# EAGLE design Costume Controller Base Board (EAGLE 6.5.0)
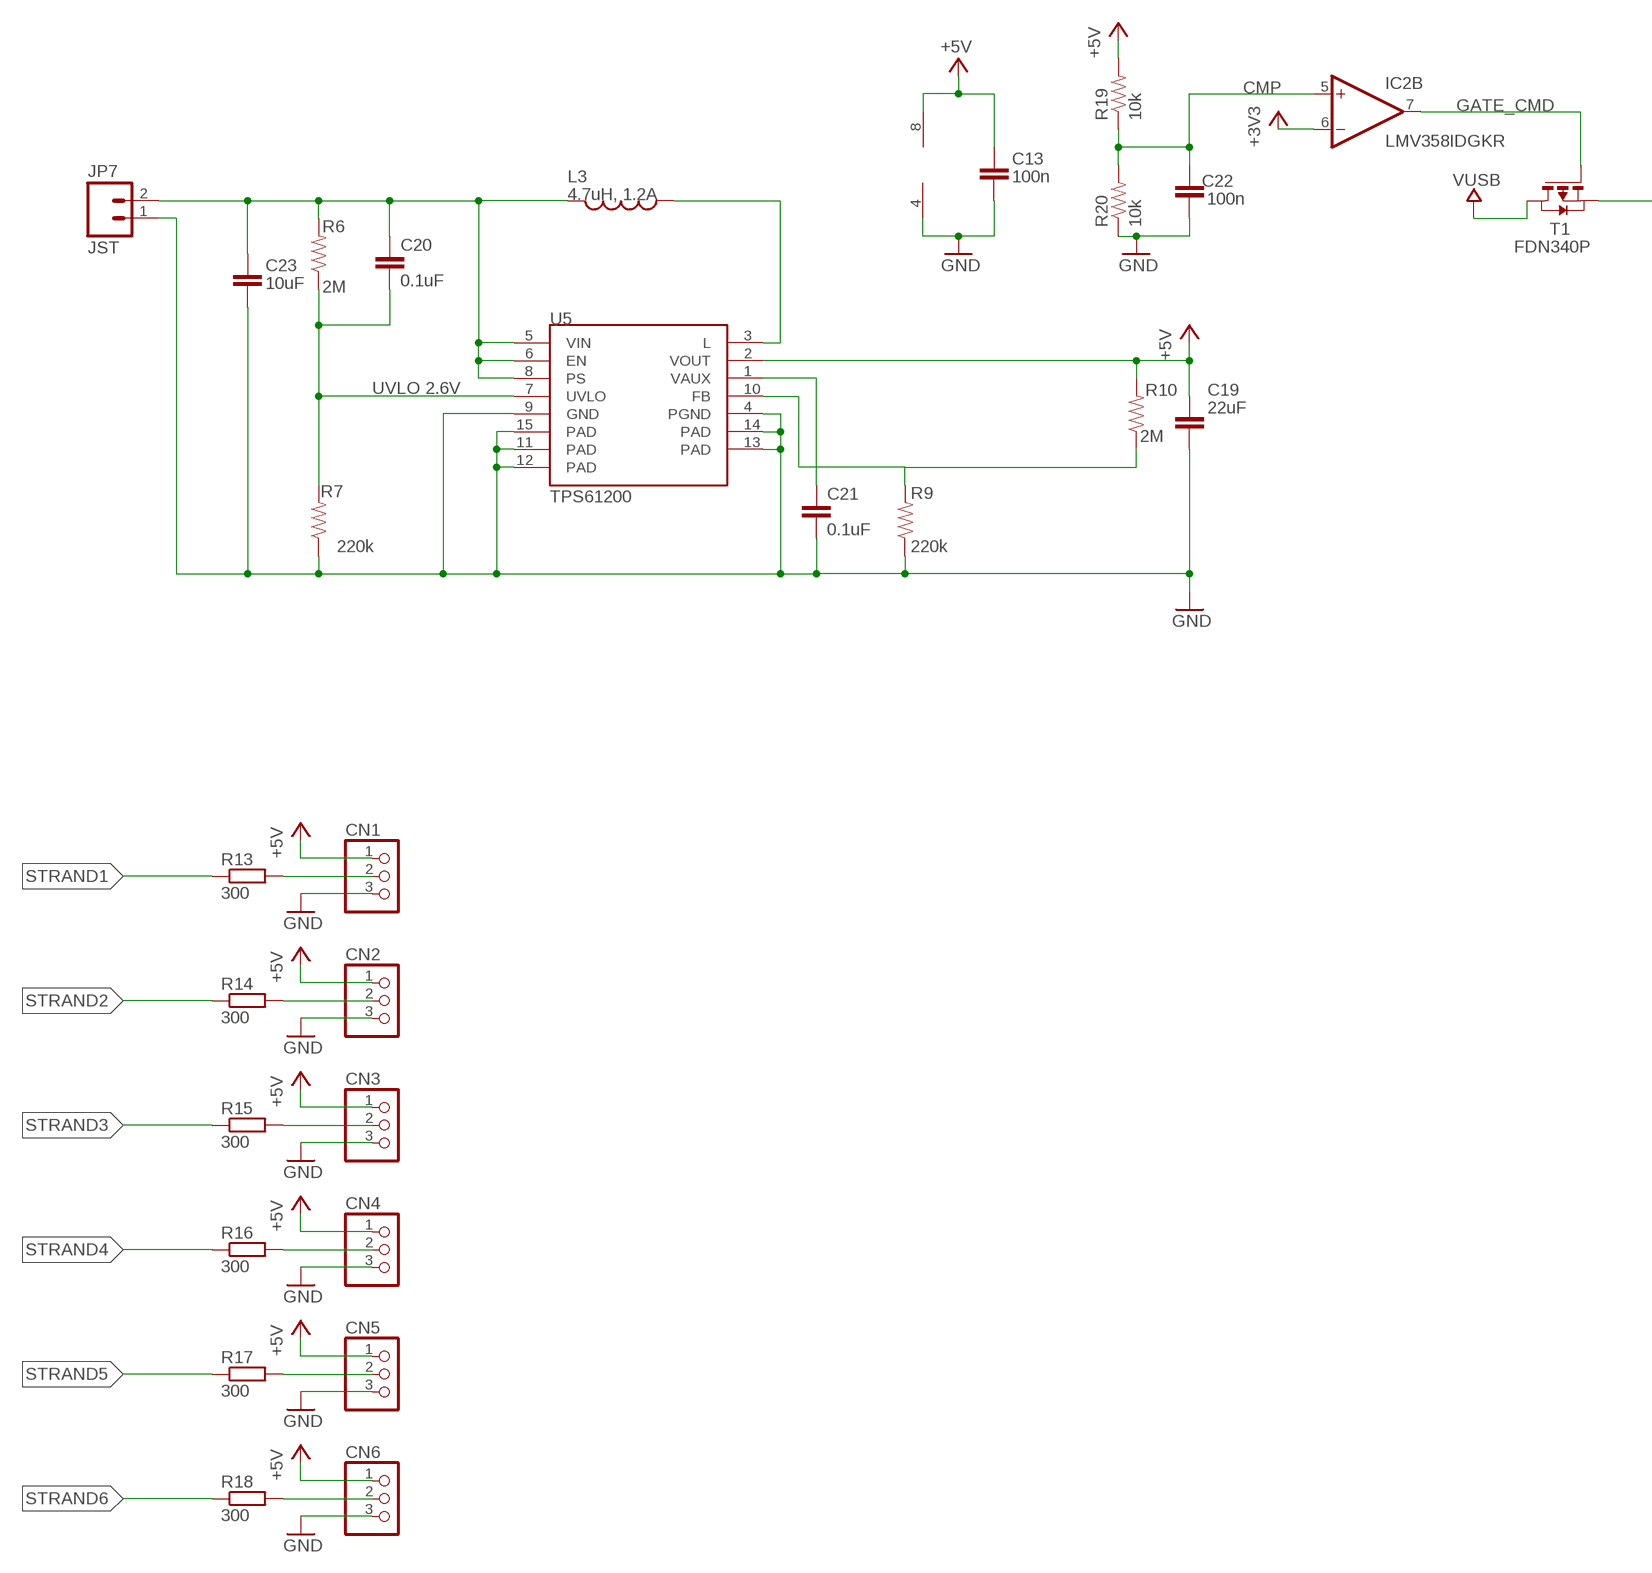
[diagram p0: schematic, sheet 1, part 1 of 2]
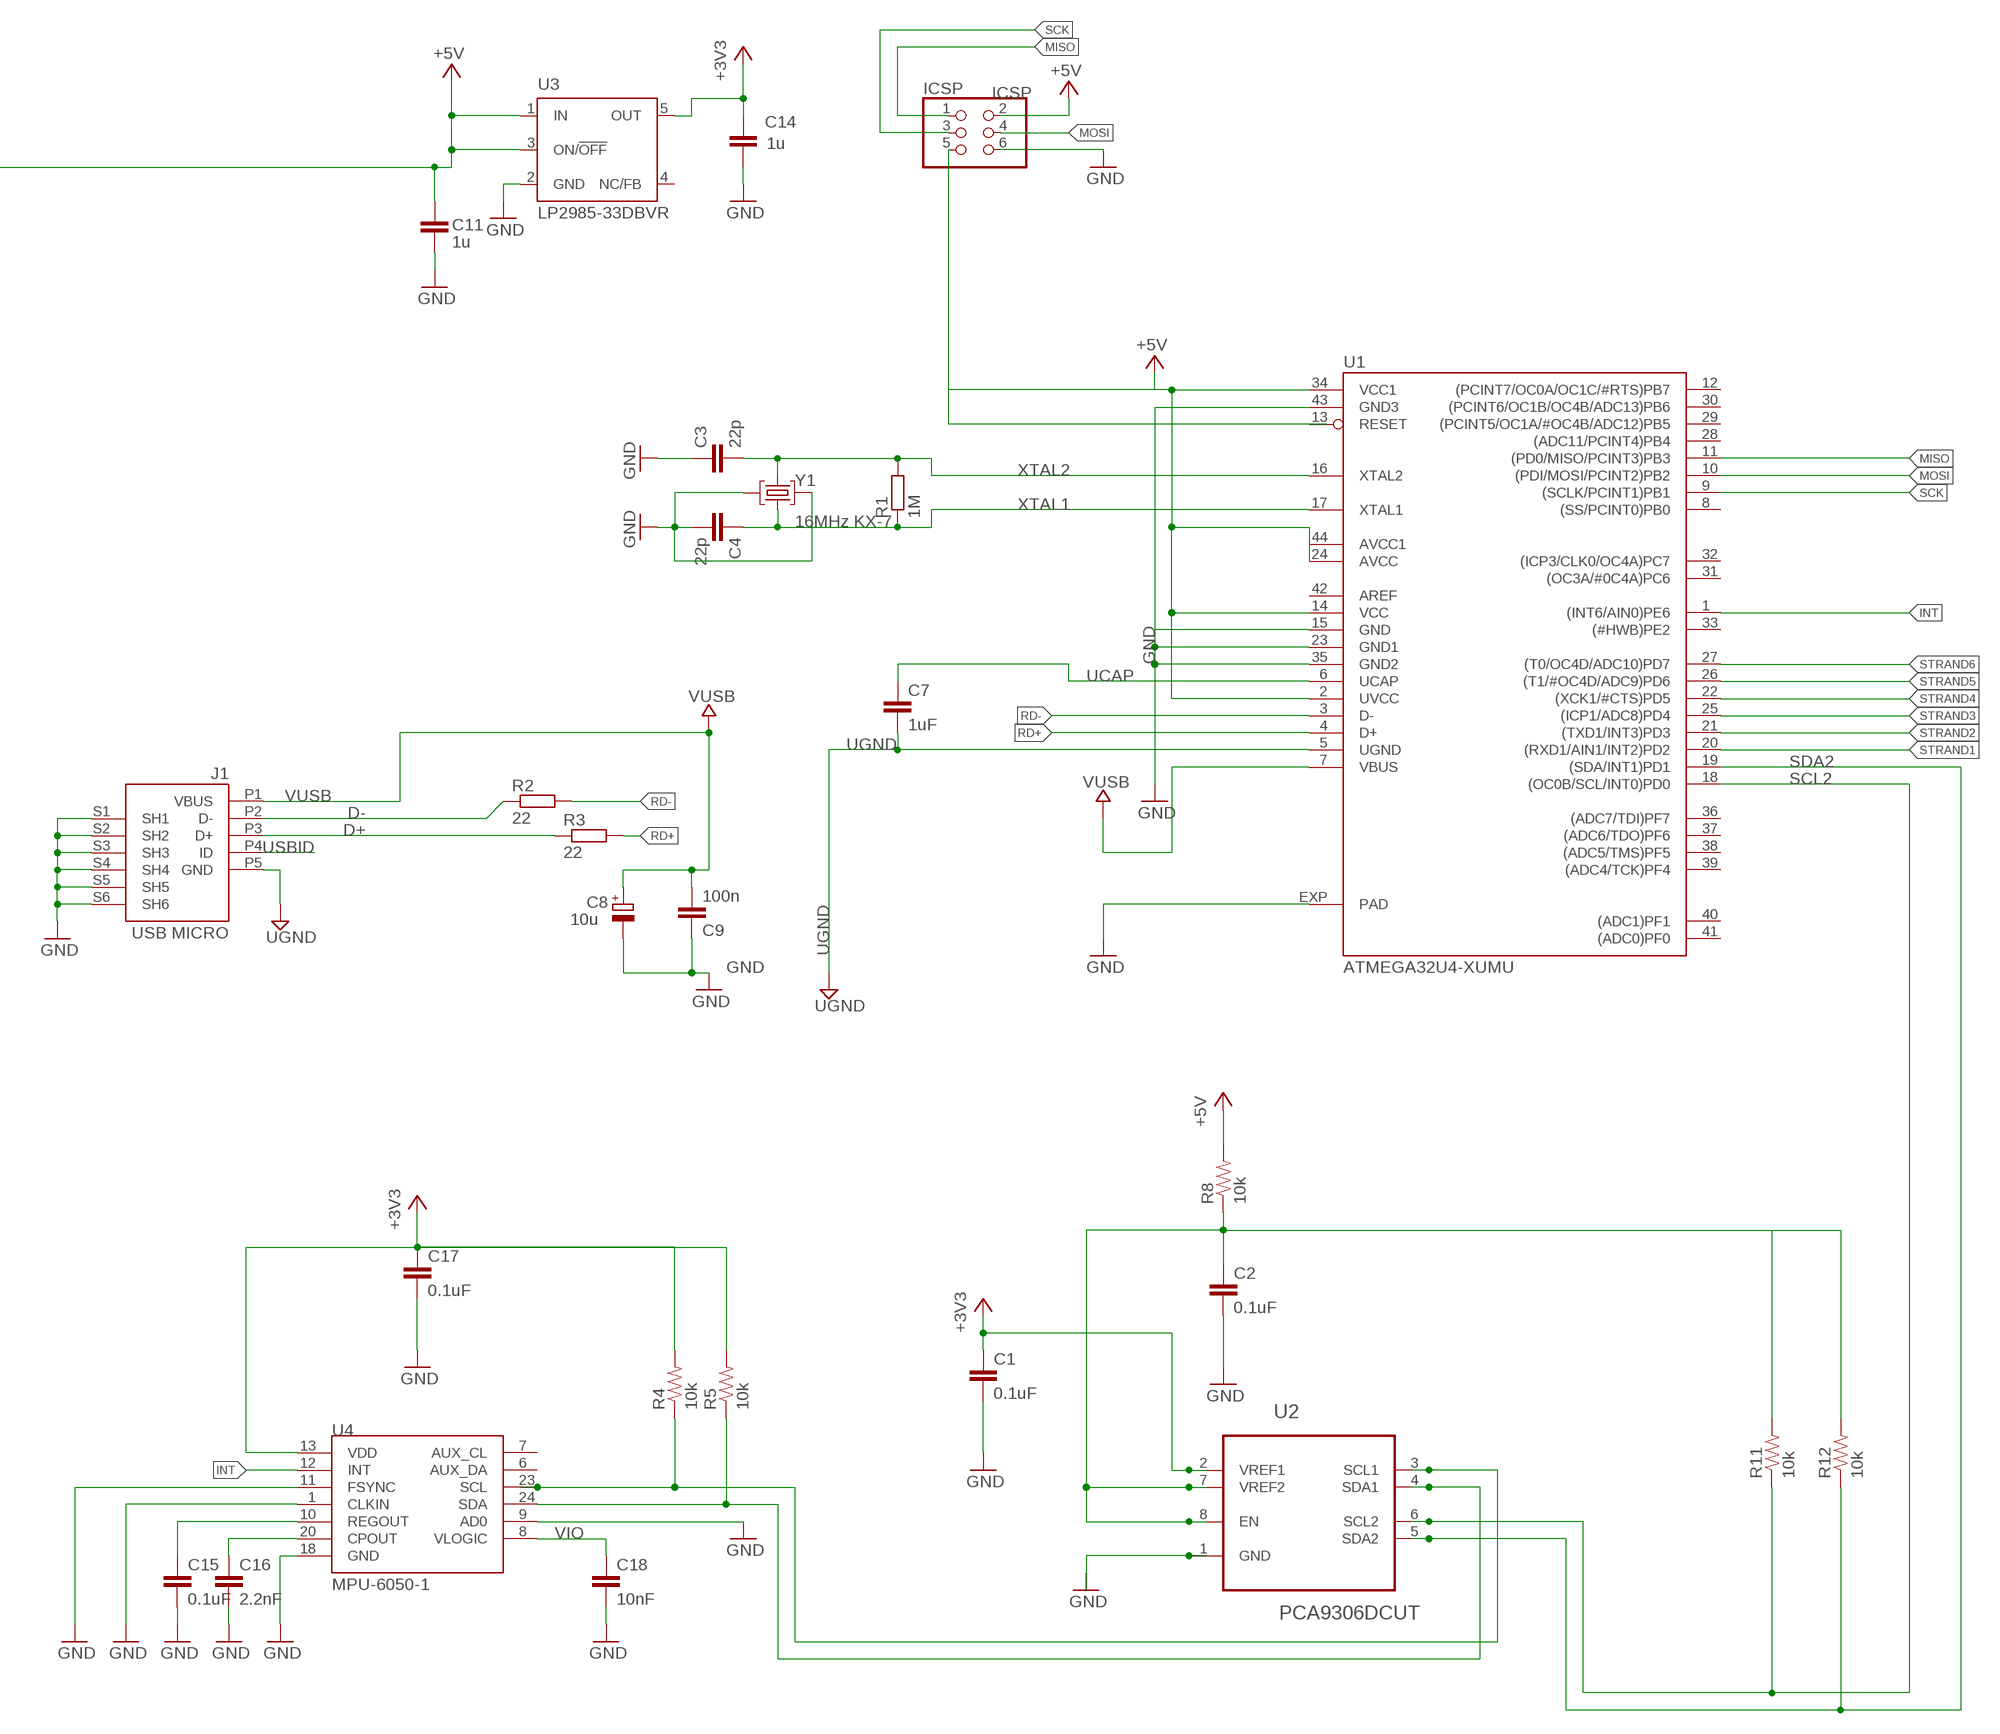
[diagram p1: schematic, sheet 1, part 2 of 2]

## Parts
C1  0.1uF  CAP0603-CAP  [0603-CAP]
C2  0.1uF  CAP0603-CAP  [0603-CAP]
C3  22p  C-EUC0603  [C0603-ROUND]
C4  22p  C-EUC0603  [C0603-ROUND]
C7  1uF  C-EUC0603  [C0603-ROUND]
C8  10u  CPOL-EUSMCB  [SMC_B]
C9  100n  C-EUC0603  [C0603-ROUND]
C11  1u  C-EUC0603  [C0603-ROUND]
C13  100n  C-EUC0603  [C0603-ROUND]
C14  1u  C-EUC0603  [C0603-ROUND]
C15  0.1uF  CAP0603-CAP  [0603-CAP]
C16  2.2nF  CAP0603-CAP  [0603-CAP]
C17  0.1uF  CAP0603-CAP  [0603-CAP]
C18  10nF  CAP0603-CAP  [0603-CAP]
C19  22uF  C-EUC0603  [C0603]
C20  0.1uF  CAP0603-CAP  [0603-CAP]
C21  0.1uF  CAP0603-CAP  [0603-CAP]
C22  100n  C-EUC0603  [C0603-ROUND]
C23  10uF  CAP1206  [1206]
CN1  JST_3PIN  [JSTPH3]
CN2  JST_3PIN  [JSTPH3]
CN3  JST_3PIN  [JSTPH3]
CN4  JST_3PIN  [JSTPH3]
CN5  JST_3PIN  [JSTPH3]
CN6  JST_3PIN  [JSTPH3]
IC2  LMV358IDGKR  LMV358MMX  [MSOP08]
ICSP  ICSP  PINHD-2X3  [2X03]
J1  USB MICRO  MYCON2_USB-MINI-B  [CON2_USB_MICRO_B_AT]
JP7  JST  M02-JST-2MM-SMT  [JST-2-SMD]
L3  4.7uH, 1.2A  INDUCTOR.  [CDRH2D09]
R1  1M  R-EU_R0603  [R0603]
R2  22  R-EU_R0603  [R0603]
R3  22  R-EU_R0603  [R0603]
R4  10k  RESISTOR0603-RES  [0603-RES]
R5  10k  RESISTOR0603-RES  [0603-RES]
R6  2M  RESISTOR0603-RES  [0603-RES]
R7  220k  RESISTOR0603-RES  [0603-RES]
R8  10k  RESISTOR0603-RES  [0603-RES]
R9  220k  RESISTOR0603-RES  [0603-RES]
R10  2M  RESISTOR0603-RES  [0603-RES]
R11  10k  RESISTOR0603-RES  [0603-RES]
R12  10k  RESISTOR0603-RES  [0603-RES]
R13  300  R-EU_R0603  [R0603]
R14  300  R-EU_R0603  [R0603]
R15  300  R-EU_R0603  [R0603]
R16  300  R-EU_R0603  [R0603]
R17  300  R-EU_R0603  [R0603]
R18  300  R-EU_R0603  [R0603]
R19  10k  RESISTOR0603-RES  [0603-RES]
R20  10k  RESISTOR0603-RES  [0603-RES]
T1  FDN340P  PMOSSOT23  [SOT-23]
U1  ATMEGA32U4-XUMU  [QFN44ML7X7]
U2  PCA9306DCUT  [SOP50P310X90-8N]
U3  LP2985-33DBVR  LP2985-XXDBVR33  [SOT23-DBV]
U4  MPU-6050-1  [QFN-24-4MM2]
U5  TPS61200  [QFN-10_PAD]
Y1  16MHz KX-7  CRYSTAL-3.2-2.5  [CRYSTAL-3.2-2.5]

## Nets
+3V3: C1.1 C14.2 C17.1 IC2.6(B:-IN) R4.2 R5.2 U2.2(VREF1) U3.5(OUT) U4.13(VDD)
+5V [usbvcc]: C11.2 C13.1 C19.1 CN1.1 CN2.1 CN3.1 CN4.1 CN5.1 CN6.1 IC2.8(P:V+) ICSP.2 ICSP.5 R8.2 R10.2 R19.2 T1.2(S) U1.2(UVCC) U1.14(VCC) U1.24(AVCC) U1.34(VCC1) U1.44(AVCC1) U3.1(IN) U3.3(ON/!OFF) U5.2(VOUT)
CMP: C22.2 IC2.5(B:+IN) R19.1 R20.2
D+: J1.P3(D+) R3.1
D-: J1.P2(D-) R2.1
FB: R9.2 R10.1 U5.10(FB)
GATE_CMD: IC2.7(B:OUT) T1.3(G)
GND [gnd]: C1.2 C2.2 C3.1 C4.2 C8.- C9.1 C11.1 C13.2 C14.1 C15.2 C16.2 C17.2 C18.2 C19.2 C21.2 C22.1 C23.2 CN1.3 CN2.3 CN3.3 CN4.3 CN5.3 CN6.3 IC2.4(P:V-) ICSP.6 J1.S1(SH1) J1.S2(SH2) J1.S3(SH3) J1.S4(SH4) J1.S5(SH5) J1.S6(SH6) JP7.1 R7.1 R9.1 R20.1 U1.15(GND) U1.23(GND1) U1.35(GND2) U1.43(GND3) U1.EXP(PAD) U2.1(GND) U3.2(GND) U4.1(CLKIN) U4.9(AD0) U4.11(FSYNC) U4.18(GND) U5.4(PGND) U5.9(GND) U5.11(PAD) U5.12(PAD) U5.13(PAD) U5.14(PAD) U5.15(PAD) Y1.2(GND) Y1.4(GND)
INT: U1.1((INT6/AIN0)PE6) U4.12(INT)
MISO: ICSP.1 U1.11((PD0/MISO/PCINT3)PB3)
MOSI: ICSP.4 U1.10((PDI/MOSI/PCINT2)PB2)
N$1: C16.1 U4.20(CPOUT)
N$2: C2.1 R8.1 R11.2 R12.2 U2.7(VREF2) U2.8(EN)
N$3: CN6.2 R18.2
N$4: L3.P$1 U5.3(L)
N$5: C15.1 U4.10(REGOUT)
N$6: CN5.2 R17.2
N$7: CN4.2 R16.2
N$8: CN3.2 R15.2
N$9: C21.1 U5.1(VAUX)
N$10: CN2.2 R14.2
N$11: CN1.2 R13.2
RD+: R3.2 U1.4(D+)
RD-: R2.2 U1.3(D-)
SCK: ICSP.3 U1.9((SCLK/PCINT1)PB1)
SCL1: R4.1 U2.3(SCL1) U4.23(SCL)
SCL2: R11.1 U1.18((OC0B/SCL/INT0)PD0) U2.6(SCL2)
SDA1: R5.1 U2.4(SDA1) U4.24(SDA)
SDA2: R12.1 U1.19((SDA/INT1)PD1) U2.5(SDA2)
STRAND1: R13.1 U1.20((RXD1/AIN1/INT2)PD2)
STRAND2: R14.1 U1.21((TXD1/INT3)PD3)
STRAND3: R15.1 U1.25((ICP1/ADC8)PD4)
STRAND4: R16.1 U1.22((XCK1/#CTS)PD5)
STRAND5: R17.1 U1.26((T1/#OC4D/ADC9)PD6)
STRAND6: R18.1 U1.27((T0/OC4D/ADC10)PD7)
UCAP: C7.1 U1.6(UCAP)
UGND [gnd]: C7.2 J1.P5(GND) U1.5(UGND)
USBID: J1.P4(ID)
UVLO: C20.2 R6.1 R7.2 U5.7(UVLO)
VIN [power]: C20.1 C23.1 JP7.2 L3.P$2 R6.2 U5.5(VIN) U5.6(EN) U5.8(PS)
VIO: C18.1 U4.8(VLOGIC)
VUSB: C8.+ C9.2 J1.P1(VBUS) T1.1(D) U1.7(VBUS)
XTAL1: C4.1 R1.1 U1.17(XTAL1) Y1.1(C1)
XTAL2: C3.2 R1.2 U1.16(XTAL2) Y1.3(C2)
Unconnected: IC2.1(A:OUT) IC2.2(A:-IN) IC2.3(A:+IN) U1.8((SS/PCINT0)PB0) U1.12((PCINT7/OC0A/OC1C/#RTS)PB7) U1.13(RESET) U1.28((ADC11/PCINT4)PB4) U1.29((PCINT5/OC1A/#OC4B/ADC12)PB5) U1.30((PCINT6/OC1B/OC4B/ADC13)PB6) U1.31((OC3A/#0C4A)PC6) U1.32((ICP3/CLK0/OC4A)PC7) U1.33((#HWB)PE2) U1.36((ADC7/TDI)PF7) U1.37((ADC6/TDO)PF6) U1.38((ADC5/TMS)PF5) U1.39((ADC4/TCK)PF4) U1.40((ADC1)PF1) U1.41((ADC0)PF0) U3.4(NC/FB) U4.6(AUX_DA) U4.7(AUX_CL)

## Notes on the sheet
- UVLO 2.6V

## Power pins joined to a net without a drawn wire
AREF: U1.42(AREF)

## Library data of the parts
C1 C2 C15-C18 C20 C21 = SparkFun:CAP: Capacitor Standard 0603 ceramic capacitor, and 0.1" leaded capacitor.
C3 C4 C7 C9 C11 C13 C14 C22 = SmartPrj:C-EU: CAPACITOR, European symbol
C8 = rcl:CPOL-EU: POLARIZED CAPACITOR, European symbol
C19 = resistor:C-EU: CAPACITOR, European symbol
C23 = CH_passive:CAP: Capacitor Standard 0603 ceramic capacitor, and 0.1" leaded capacitor.
CN1-CN6 = adafruit:JST_3PIN
IC2 = linear:LMV358?*: Dual General Purpose, Low Voltage, Rail-to-Rail Output Operational Amplifiers Source: http://www.national.com/mpf/LM/LMV321.html http://www.national.com/dt/lmv_qual.pdf
ICSP = SmartPrj:PINHD-2X3: PIN HEADER
J1 = SmartPrj:MYCON2_USB-MINI-B
JP7 = SparkFun:M02: Header 2 Standard 2-pin 0.1" header. Use with straight break away headers (SKU : PRT-00116), right angle break away headers (PRT-00553), swiss pins (PRT-00743), machine pins (PRT-00117), and female headers (PRT-00115). Molex polarized connector foot print use with SKU : PRT-08233 with associated crimp pins and housings.
L3 = SparkFun:INDUCTOR: Inductors Basic Inductor/Choke - 0603 and 1206. Footprints are not proven and vary greatly between part numbers.
R1-R3 R13-R18 = resistor:R-EU_: RESISTOR, European symbol
R4-R12 R19 R20 = SparkFun:RESISTOR: Resistor Basic schematic elements and footprints for 0603, 1206, and PTH resistors.
T1 = zetex:PMOSSOT23: MOS FET
U1 = SmartPrj:ATMEGA32U4-XU
U2 = Texas Instruments_By_element14_Batch_1:PCA9306DCUT: VOLTAGE-LEVEL TRANSLATOR; MPN: PCA9306DCUT; OC_FARNELL: -; OC_NEWARK: 24K4705; PACKAGE: VSSOP-8; SUPPLIER: Texas Instruments
U3 = SmartPrj:LP2985-XXDBVR: ULTRALOW-POWER 50-mA LOW-DROPOUT LINEAR REGULATORS 50-mA Low-Dropout Regulator Source: http://focus.ti.com/lit/ds/symlink/tps77001.pdf
U4 = Testing:MPU-6050
U5 = SparkFun:TPS61200: DC to DC Booster
Y1 = SmartPrj:CRYSTAL-3.2-2.5

## Net classes
1 power: width 0.254 mm, drill 0.61 mm, clearance 0.254 mm
2 gnd: width 0.254 mm, drill 0.61 mm, clearance 0.254 mm
3 usbvcc: width 0.254 mm, drill 0.61 mm, clearance 0.254 mm
4 aref: width 0.254 mm, drill 0.61 mm, clearance 0.254 mm

## Board
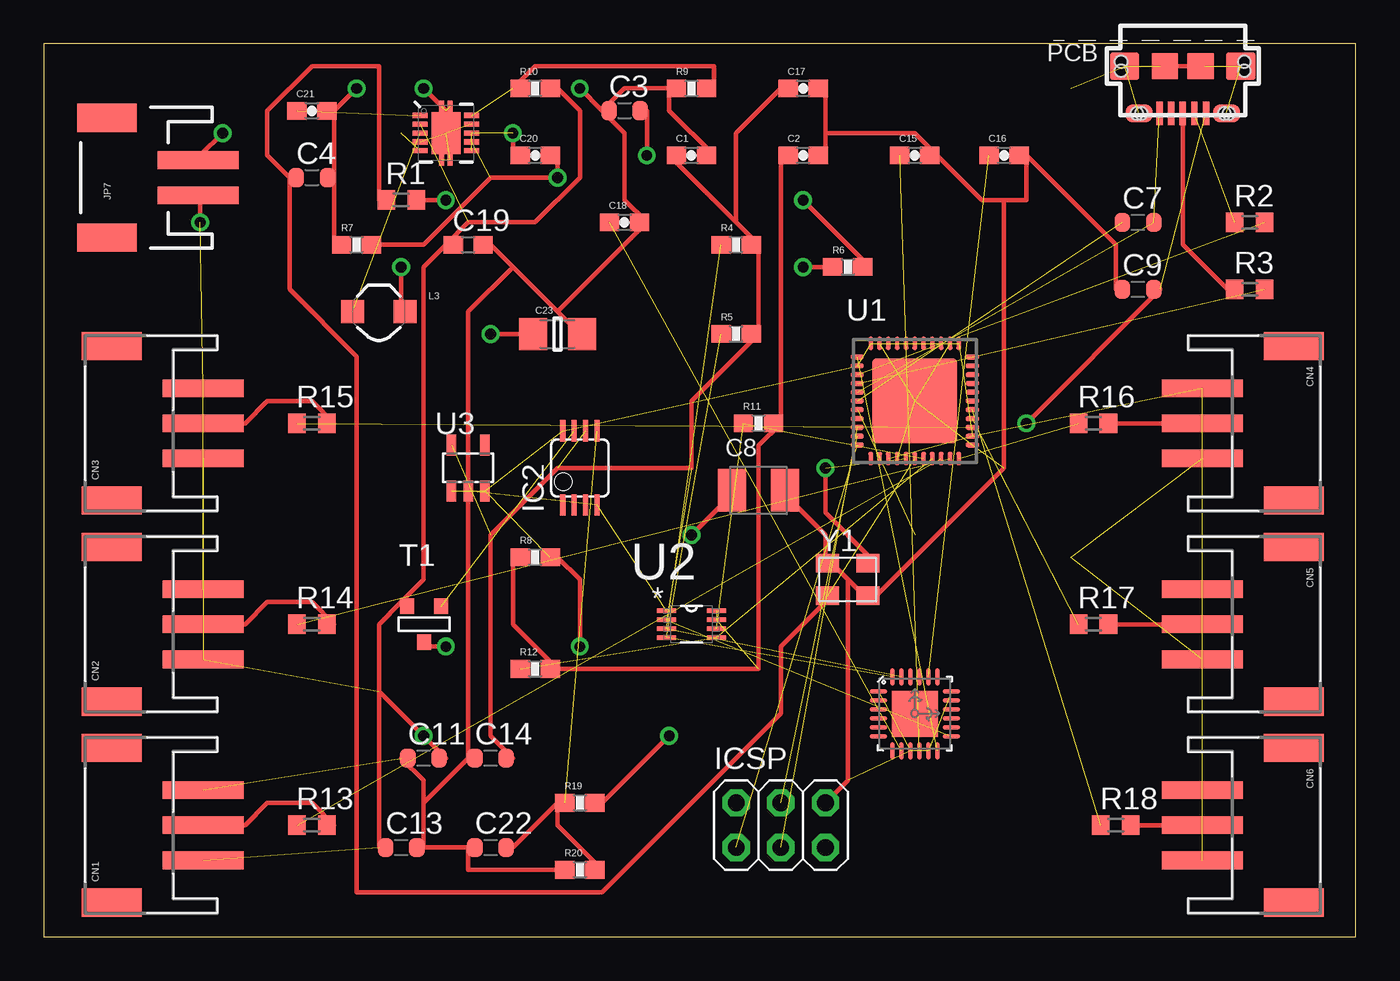
[diagram p2: board, top side]
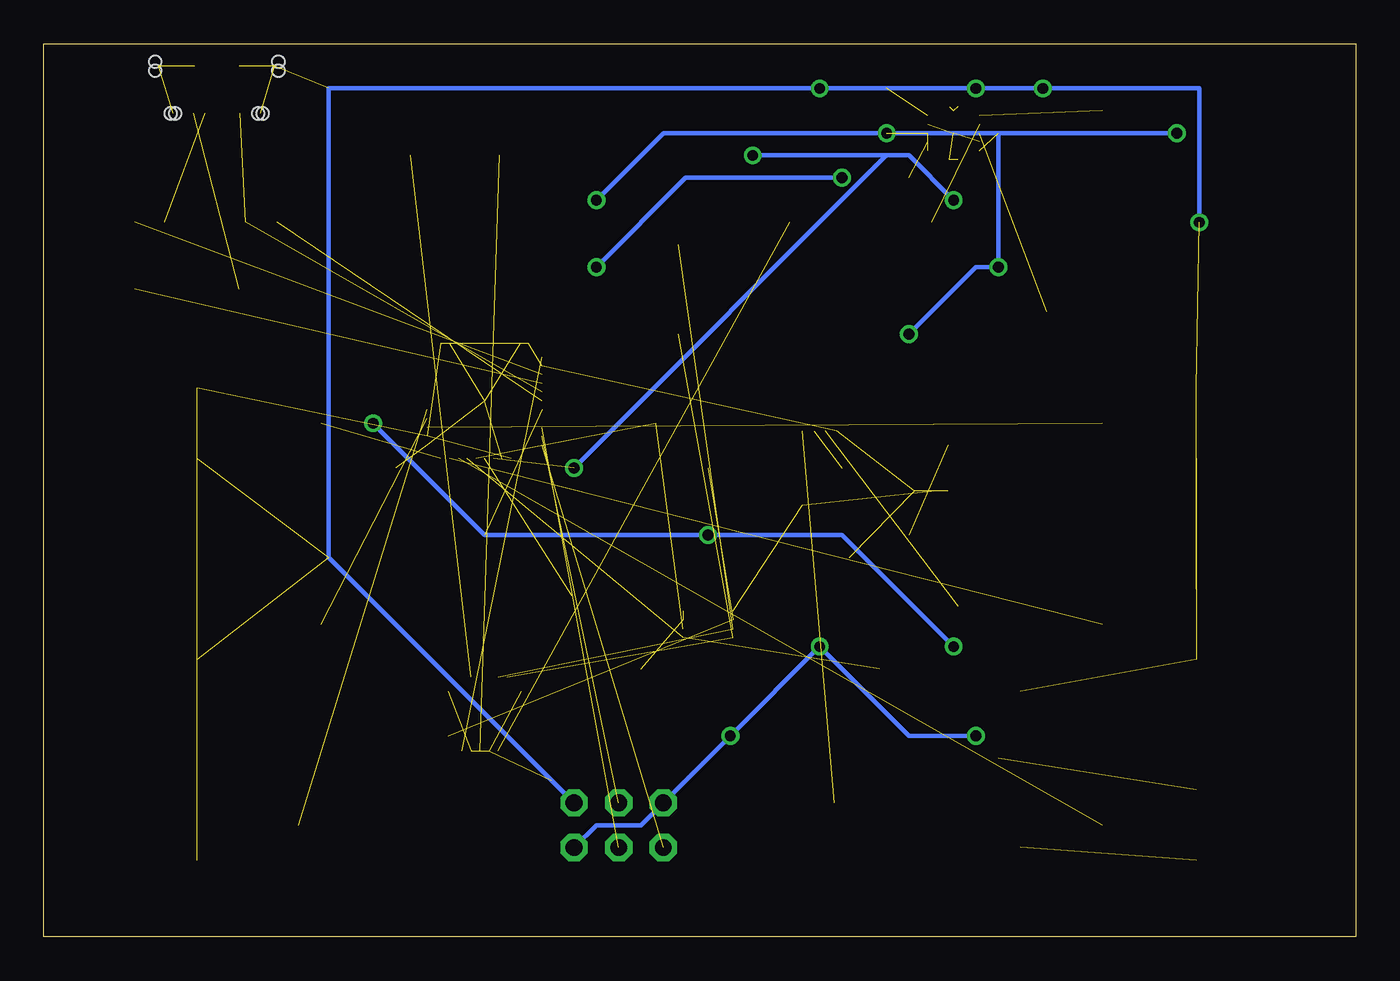
[diagram p3: board, bottom side, seen from below]

Size 74.6 x 50.79 mm. Coordinates in mm from the lower left corner, seen from the top.
Outline: 0,0 74.6,0 74.6,50.79 0,50.79 0,0
Copper layers (1*16): Top 0.035mm / dielectric 1.5mm / Bottom 0.035mm
Design rules "default": minimum track width 10mil, minimum drill 24mil, track to track 8mil, track to pad 8mil, pad to pad 8mil, via to via 8mil, smd to smd 8mil, copper to edge 40mil, drill to drill 8mil, minimum pad ring 10mil, minimum via ring 8mil, stop-mask expansion 4mil, vias tented up to drill 0mil, thermal gap 10mil

### Footprints (pad centres in the part's own frame; a part is rotated, then mirrored left to right if it is on the bottom)
0603-CAP = smd 1.1 x 1: 1 -0.85,0; 2 0.85,0
C0603-ROUND = smd 0.898 x 1.1: 1 -0.889,0; 2 0.889,0
SMC_B = smd 1.6 x 2.4: + -1.5,0; - 1.5,0
C0603 = smd 1.1 x 1: 1 -0.85,0; 2 0.85,0
1206 = smd 1.6 x 1.8: 1 -1.4,0; 2 1.4,0
JSTPH3 = smd 1 x 4.6: 1 -2,-2.7; 2 0,-2.7; 3 2,-2.7 | smd 1.6 x 3.4: NC1 -4.4,2.5; NC2 4.4,2.5
MSOP08 = smd 0.3 x 1.2: 1 -0.976,-2.113; 2 -0.326,-2.113; 3 0.324,-2.113; 4 0.974,-2.113; 5 0.974,2.112; 6 0.324,2.112; 7 -0.326,2.112; 8 -0.976,2.112
2X03 = drill 0.95 pad 1.55 octagon: 1 -2.54,-1.27; 2 -2.54,1.27; 3 0,-1.27; 4 0,1.27; 5 2.54,-1.27; 6 2.54,1.27
CON2_USB_MICRO_B_AT = smd 0.406 x 1.346: P1 -1.321,2.692; P2 -0.66,2.692; P3 0,2.692; P4 0.66,2.692; P5 1.321,2.692 | smd 1.651 x 1.549: S1 -3.302,0; S2 3.302,0 | smd 1.524 x 1.016: S3 -2.489,2.692; S4 2.489,2.692 | smd 1.524 x 1.524: S5 -1.016,0; S6 1.016,0 | hole 0.7: -3.505,0.254; -3.505,-0.254; 3.505,0.254; 3.505,-0.254; -2.616,2.692; -2.362,2.692; 2.362,2.692; 2.616,2.692
JST-2-SMD = smd 1 x 4.6: 1 -1,-3.7; 2 1,-3.7 | smd 1.6 x 3.4: NC1 -3.4,1.5; NC2 3.4,1.5
CDRH2D09 = smd 1.3 x 1.3: P$1 -1.5,0; P$2 1.5,0
R0603 = smd 1 x 1.1: 1 -0.85,0; 2 0.85,0
0603-RES = smd 1.1 x 1: 1 -0.85,0; 2 0.85,0
SOT-23 = smd 0.787 x 0.889: 1 0.025,-1.016; 2 -0.94,1.016; 3 0.991,1.016
QFN44ML7X7 = smd 0.75 x 0.275: 1 -3.275,2.5; 2 -3.275,2; 3 -3.275,1.5; 4 -3.275,1; 5 -3.275,0.5; 6 -3.275,0; 7 -3.275,-0.5; 8 -3.275,-1; 9 -3.275,-1.5; 10 -3.275,-2; 11 -3.275,-2.5; 23 3.275,-2.5; 24 3.275,-2; 25 3.275,-1.5; 26 3.275,-1; 27 3.275,-0.5; 28 3.275,0; 29 3.275,0.5; 30 3.275,1; 31 3.275,1.5; 32 3.275,2; 33 3.275,2.5 | smd 0.275 x 0.75: 12 -2.5,-3.275; 13 -2,-3.275; 14 -1.5,-3.275; 15 -1,-3.275; 16 -0.5,-3.275; 17 0,-3.275; 18 0.5,-3.275; 19 1,-3.275; 20 1.5,-3.275; 21 2,-3.275; 22 2.5,-3.275; 34 2.5,3.275; 35 2,3.275; 36 1.5,3.275; 37 1,3.275; 38 0.5,3.275; 39 0,3.275; 40 -0.5,3.275; 41 -1,3.275; 42 -1.5,3.275; 43 -2,3.275; 44 -2.5,3.275 | smd 4.826 x 4.826: EXP 0,0
SOP50P310X90-8N = smd 1.067 x 0.254: 1 -1.422,0.762; 2 -1.422,0.254; 3 -1.422,-0.254; 4 -1.422,-0.762; 5 1.422,-0.762; 6 1.422,-0.254; 7 1.422,0.254; 8 1.422,0.762
SOT23-DBV = smd 0.55 x 1.2: 1 -0.95,-1.3; 2 0,-1.3; 3 0.95,-1.3; 4 0.95,1.3; 5 -0.95,1.3
QFN-24-4MM2 = smd 1.016 x 0.254: 1 -2.066,1.257; 2 -2.066,0.75; 3 -2.066,0.247; 4 -2.066,-0.287; 5 -2.066,-0.792; 6 -2.066,-1.297; 13 2.086,-1.297; 14 2.086,-0.792; 15 2.086,-0.287; 16 2.086,0.247; 17 2.086,0.75; 18 2.086,1.257 | smd 0.254 x 1.016: 7 -1.267,-2.122; 8 -0.762,-2.122; 9 -0.258,-2.122; 10 0.278,-2.122; 11 0.78,-2.122; 12 1.287,-2.122; 19 1.287,2.082; 20 0.78,2.082; 21 0.278,2.082; 22 -0.258,2.082; 23 -0.762,2.082; 24 -1.267,2.082 | smd 2.616 x 2.616: P$1 0.02,-0.01
QFN-10_PAD = smd 0.297 x 0.85: 1 -1,-1.475; 2 -0.5,-1.475; 3 0,-1.475; 4 0.5,-1.475; 5 1,-1.475; 6 1,1.475; 7 0.5,1.475; 8 0,1.475; 9 -0.5,1.475; 10 -1,1.475 | smd 0.7 x 0.28: 11 -1.5,0.25; 12 -1.5,-0.25; 13 1.5,0.25; 14 1.5,-0.25 | smd 2.4 x 1.65: 15 0,0
CRYSTAL-3.2-2.5 = smd 1.3 x 1.05: 1 -1.15,-0.925; 2 1.15,-0.925; 3 1.15,0.925; 4 -1.15,0.925

### Placement (x,y rotation side)
C1  36.83,44.45 0 top
C2  43.18,44.45 0 top
C3  33.02,46.99 0 top
C4  15.24,43.18 0 top
C7  62.23,40.64 0 top
C8  40.64,25.4 0 top
C9  62.23,36.83 0 top
C11  21.59,10.16 0 top
C13  20.32,5.08 0 top
C14  25.4,10.16 0 top
C15  49.53,44.45 0 top
C16  54.61,44.45 0 top
C17  43.18,48.26 0 top
C18  33.02,40.64 0 top
C19  24.13,39.37 0 top
C20  27.94,44.45 0 top
C21  15.24,46.99 0 top
C22  25.4,5.08 0 top
C23  29.21,34.29 0 top
CN1  6.35,6.35 90 top
CN2  6.35,17.78 90 top
CN3  6.35,29.21 90 top
CN4  68.58,29.21 270 top
CN5  68.58,17.78 270 top
CN6  68.58,6.35 270 top
IC2  30.48,26.67 0 top
ICSP  41.91,6.35 0 top
J1  64.77,49.53 180 top
JP7  5.08,43.18 90 top
L3  19.05,35.56 0 top
R1  20.32,41.91 0 top
R2  68.58,40.64 0 top
R3  68.58,36.83 0 top
R4  39.37,39.37 0 top
R5  39.37,34.29 0 top
R6  45.72,38.1 0 top
R7  17.78,39.37 0 top
R8  27.94,21.59 0 top
R9  36.83,48.26 0 top
R10  27.94,48.26 0 top
R11  40.64,29.21 0 top
R12  27.94,15.24 0 top
R13  15.24,6.35 0 top
R14  15.24,17.78 0 top
R15  15.24,29.21 0 top
R16  59.69,29.21 0 top
R17  59.69,17.78 0 top
R18  60.96,6.35 0 top
R19  30.48,7.62 0 top
R20  30.48,3.81 0 top
T1  21.59,17.78 0 top
U1  49.53,30.48 0 top
U2  36.83,17.78 0 top
U3  24.13,26.67 0 top
U4  49.53,12.7 0 top
U5  22.86,45.72 270 top
Y1  45.72,20.32 0 top

### Tracks (layer width: path | path; a pad name or v marks a point on that pad's centre or on a via)
+3V3  (4 unrouted)
  Top 0.254: 40.64,34.29 36.83,30.48 36.83,26.67 29.21,26.67 25.4,22.86 25.4,11.43 26.67,10.16 C14.2 | 40.64,34.29 40.64,39.37 | 40.64,34.29 R5.2 | 40.64,39.37 39.37,40.64 | 39.37,40.64 35.56,44.45 C1.1 | 40.64,39.37 R4.2 | 39.37,40.64 39.37,45.72 41.91,48.26 C17.1
+5V  (via drill 0.61)  (15 unrouted)
  Top 0.254: v30.48,16.51 30.48,20.32 29.21,21.59 R8.2 | v35.56,11.43 31.75,7.62 R19.2 | 20.32,19.05 19.05,17.78 19.05,13.97 | 19.05,13.97 19.05,5.08 C13.1 | 19.05,13.97 v21.59,11.43 22.86,10.16 C11.2 | 22.86,39.37 21.59,38.1 21.59,20.32 20.32,19.05 | 20.32,19.05 T1.2 | 22.86,39.37 24.13,40.64 27.94,40.64 30.48,43.18 30.48,46.99 29.21,48.26 R10.2 | 22.86,39.37 C19.1
  Bottom 0.254: ICSP.5 43.18,6.35 40.64,6.35 ICSP.2 v35.56,11.43 v30.48,16.51 25.4,11.43 v21.59,11.43
CMP  (1 unrouted)
  Top 0.254: 29.21,7.62 26.67,5.08 C22.2 | 29.21,7.62 29.21,6.35 31.75,3.81 R20.2 | 29.21,7.62 R19.1
D+
  Top 0.254: R3.1 67.31,36.83 64.77,39.37 J1.P3 64.77,46.99
D-  (1 unrouted)
FB  (1 unrouted)
  Top 0.254: R10.1 26.67,48.26 27.94,49.53 38.1,49.53 38.1,48.26 R9.2
GATE_CMD  (1 unrouted)
GND  (via drill 0.61)  (28 unrouted)
  Top 0.254: 63.5,49.53 J1.S6 J1.S5 66.04,49.53 | 44.45,21.59 45.72,20.32 | 45.72,20.32 46.99,19.05 | 44.45,21.59 44.45,22.86 41.91,25.4 C8.- | 44.45,21.59 Y1.4 | ICSP.6 45.72,8.89 45.72,20.32 | 44.45,45.72 44.45,48.26 C17.2 | 44.45,45.72 44.45,44.45 C2.2 | 50.8,44.45 49.53,45.72 44.45,45.72 | 55.88,44.45 60.96,39.37 60.96,36.83 C9.1 | 50.8,44.45 53.34,41.91 54.61,41.91 | 54.61,41.91 55.88,41.91 55.88,44.45 | 50.8,44.45 C15.2 | 55.88,44.45 C16.2 | 46.99,19.05 54.61,26.67 54.61,41.91 | 46.99,19.05 Y1.2 | 24.13,5.08 21.59,5.08 | 21.59,5.08 21.59,7.62 | 21.59,7.62 21.59,8.89 20.32,10.16 C11.1 | 21.59,5.08 C13.2 | 21.59,7.62 24.13,10.16 | R20.1 24.13,3.81 24.13,5.08 | 24.13,5.08 C22.1 | 24.13,10.16 U3.2 24.13,35.56 26.67,38.1 | 24.13,10.16 C14.1 | 16.51,46.99 16.51,43.18 | 16.51,43.18 16.51,39.37 R7.1 | 16.51,43.18 C4.2 | U5.15 22.86,46.99 v21.59,48.26 | 16.51,46.99 v17.78,48.26 | 16.51,46.99 C21.2 | v8.89,40.64 8.89,41.91 JP7.1 | 35.56,48.26 35.56,46.99 38.1,44.45 C1.2 | 31.75,46.99 33.02,48.26 35.56,48.26 | 35.56,48.26 R9.1 | 29.21,35.56 30.48,34.29 C23.2 | 29.21,35.56 26.67,38.1 | 26.67,38.1 25.4,39.37 C19.2 | 29.21,35.56 34.29,40.64 | 31.75,46.99 33.02,45.72 33.02,41.91 34.29,40.64 | 34.29,40.64 C18.2 | 31.75,46.99 v30.48,48.26 | 31.75,46.99 C3.1
  Bottom 0.254: v8.89,40.64 8.89,48.26 v17.78,48.26 v21.59,48.26 v30.48,48.26 58.42,48.26 58.42,21.59 ICSP.6
INT  (1 unrouted)
MISO  (1 unrouted)
MOSI  (1 unrouted)
N$1  (1 unrouted)
N$2  (2 unrouted)
  Top 0.254: 29.21,15.24 26.67,17.78 26.67,21.59 R8.1 | 41.91,29.21 41.91,44.45 C2.1 | 29.21,15.24 40.64,15.24 40.64,27.94 41.91,29.21 | 29.21,15.24 R12.2 | 41.91,29.21 R11.2
N$3
  Top 0.254: CN6.2 R18.2
N$4  (1 unrouted)
N$5  (1 unrouted)
N$6
  Top 0.254: CN5.2 R17.2
N$7
  Top 0.254: CN4.2 R16.2
N$8
  Top 0.254: CN3.2 11.43,29.21 12.7,30.48 15.24,30.48 16.51,29.21 R15.2
N$9  (1 unrouted)
N$10
  Top 0.254: CN2.2 11.43,17.78 12.7,19.05 15.24,19.05 16.51,17.78 R14.2
N$11
  Top 0.254: CN1.2 11.43,6.35 12.7,7.62 15.24,7.62 16.51,6.35 R13.2
RD+  (1 unrouted)
RD-  (1 unrouted)
SCK  (1 unrouted)
SCL1  (2 unrouted)
SCL2  (2 unrouted)
SDA1  (2 unrouted)
SDA2  (2 unrouted)
STRAND1  (1 unrouted)
STRAND2  (1 unrouted)
STRAND3  (1 unrouted)
STRAND4  (1 unrouted)
STRAND5  (1 unrouted)
STRAND6  (1 unrouted)
UCAP  (1 unrouted)
UGND  (2 unrouted)
UVLO  (via drill 0.61)  (1 unrouted)
  Top 0.254: R7.2 21.59,39.37 25.4,43.18 v29.21,43.18 29.21,44.45 C20.2 | v43.18,38.1 R6.1
  Bottom 0.254: v43.18,38.1 38.1,43.18 v29.21,43.18
VIN  (via drill 0.61)  (3 unrouted)
  Top 0.254: v26.67,45.72 26.67,44.45 C20.1 | v10.16,45.72 8.89,44.45 JP7.2 | v43.18,41.91 46.99,38.1 R6.2 | v20.32,38.1 20.32,35.56 L3.P$2 | v25.4,34.29 C23.1 27.94,34.29
  Bottom 0.254: v10.16,45.72 20.32,45.72 | 20.32,45.72 v26.67,45.72 39.37,45.72 v43.18,41.91 | 20.32,45.72 v20.32,38.1 21.59,38.1 v25.4,34.29
VIO  (1 unrouted)
VUSB  (via drill 0.61)  (2 unrouted)
  Top 0.254: v22.86,16.51 21.59,16.51 T1.1 | v36.83,22.86 39.37,25.4 C8.+ | v55.88,29.21 63.5,36.83 C9.2
  Bottom 0.254: v22.86,16.51 29.21,22.86 v36.83,22.86 49.53,22.86 v55.88,29.21
XTAL1  (1 unrouted)
  Top 0.254: 13.97,43.18 12.7,44.45 12.7,46.99 15.24,49.53 19.05,49.53 19.05,41.91 R1.1 | 13.97,43.18 13.97,36.83 17.78,33.02 17.78,2.54 31.75,2.54 41.91,12.7 41.91,16.51 44.45,19.05 Y1.1 | 13.97,43.18 C4.1
XTAL2  (via drill 0.61)  (1 unrouted)
  Top 0.254: v22.86,41.91 R1.2 | v34.29,44.45 34.29,46.99 C3.2 | v44.45,26.67 44.45,24.13 46.99,21.59 Y1.3
  Bottom 0.254: v22.86,41.91 25.4,44.45 26.67,44.45 | v34.29,44.45 26.67,44.45 | 26.67,44.45 v44.45,26.67